# EAGLE schematic mains_module (EAGLE 8.4.1)
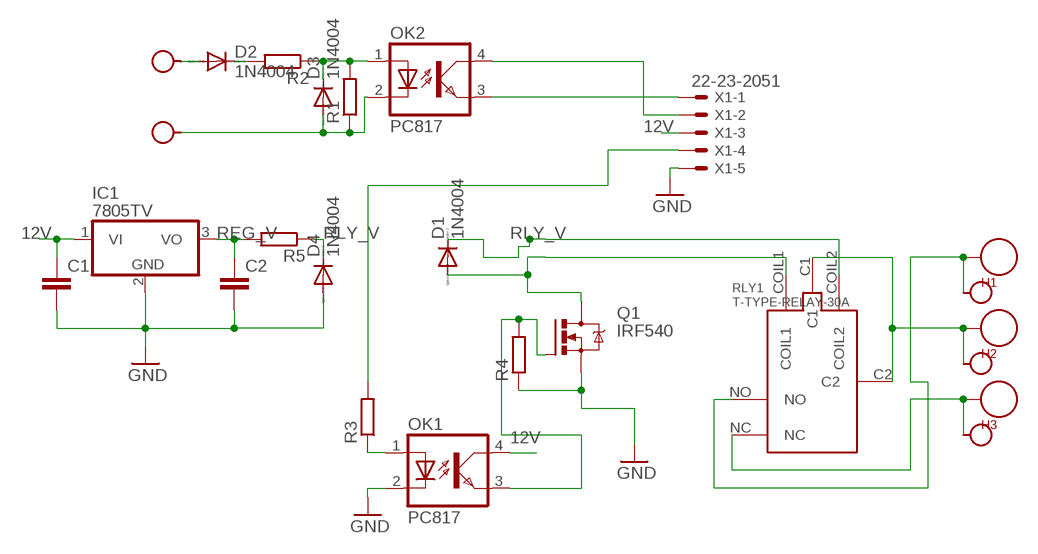
[diagram p0: schematic, sheet 1]

## Parts
C1  C2,5-3  [C2.5-3]
C2  C2,5-3  [C2.5-3]
D1  1N4004  [DO41-10]
D2  1N4004  [DO41-10]
D3  1N4004  [DO41-10]
D4  1N4004  [DO41-10]
H1  SEW_HOLE  [SIMPLE_HOLE]
H2  SEW_HOLE  [SIMPLE_HOLE]
H3  SEW_HOLE  [SIMPLE_HOLE]
H4  SEW_HOLE-SMALL  [SIMPLE_HOLE_SM]
H5  SEW_HOLE-SMALL  [SIMPLE_HOLE_SM]
H6  SEW_HOLE-SMALL  [SIMPLE_HOLE_SM]
H7  SEW_HOLE-SMALL  [SIMPLE_HOLE_SM]
H8  SEW_HOLE-SMALL  [SIMPLE_HOLE_SM]
IC1  7805TV  [TO220V]
OK1  PC817  [DIL04]
OK2  PC817  [DIL04]
Q1  IRF540  [TO220BV]
R1  R-EU_0207/7  [0207/7]
R2  R-EU_0207/7  [0207/7]
R3  R-EU_0207/7  [0207/7]
R4  R-EU_0207/7  [0207/7]
R5  R-EU_0207/7  [0207/7]
RLY1  T-TYPE-RELAY-30A  [T-TYPE-RELAY-30A]
X1  22-23-2051  [22-23-2051]

## Nets
12V: C1.1 IC1.1(VI) OK1.4(COL) X1.3
GND: C1.2 C2.2 D4.A IC1.2(GND) OK1.2(C) Q1.S R4.1 X1.5
N$1: OK2.3(EMIT) X1.1
N$2: OK2.4(COL) X1.2
N$3: H1.P$1 H4.P$1 RLY1.NO
N$4: OK1.1(A) R3.1
N$5: D1.A Q1.D RLY1.COIL1
N$6: R3.2 X1.4
N$7: OK1.3(EMIT) Q1.G R4.2
N$8: D2.C R2.2
N$9: H3.P$1 H6.P$1 RLY1.NC
N$10: D2.A H8.P$1
N$12: D3.C OK2.1(A) R1.2 R2.1
N$13: D3.A H7.P$1 OK2.2(C) R1.1
N$14: H2.P$1 H5.P$1 RLY1.C1 RLY1.C2
REG_V: C2.1 IC1.3(VO) R5.2
RLY_V: D1.C D4.C R5.1 RLY1.COIL2

## Library data of the parts
C1 C2 = capacitor-wima:C: CAPACITOR naming: grid - package width
D1-D4 = diode:1N4004: DIODE general purpose rectifier, 1 A
H1-H3 = LilyPad-Wearables:SEW_HOLE: Simple sew-hole .1" diameter hole with 20mil annular ring
H4-H8 = LilyPad-Wearables:SEW_HOLE-SMALL: .070" hole with 20mil annular ring
IC1 = linear:78*: Positive VOLTAGE REGULATOR Source: http://cache.national.com/ds/LM/LM78L05.pdf http://www.fairchildsemi.com/ds/LM/LM7805.pdf
OK1 OK2 = optocoupler:PC817: SHARP OPTO COUPLER; MPN: PC817X4J000F; OC_FARNELL: 9707727; OC_NEWARK: 97K7059
Q1 = transistor-power:IRF540: HEXFET Power MOSFET
R1-R5 = rcl:R-EU_: RESISTOR, European symbol
RLY1 = T-type-relay:T-TYPE-RELAY-30A
X1 = con-molex:22-23-2051: .100" (2.54mm) Center Header - 5 Pin; MF: MOLEX; MPN: 22-23-2051; OC_FARNELL: 1462952; OC_NEWARK: 38C9178